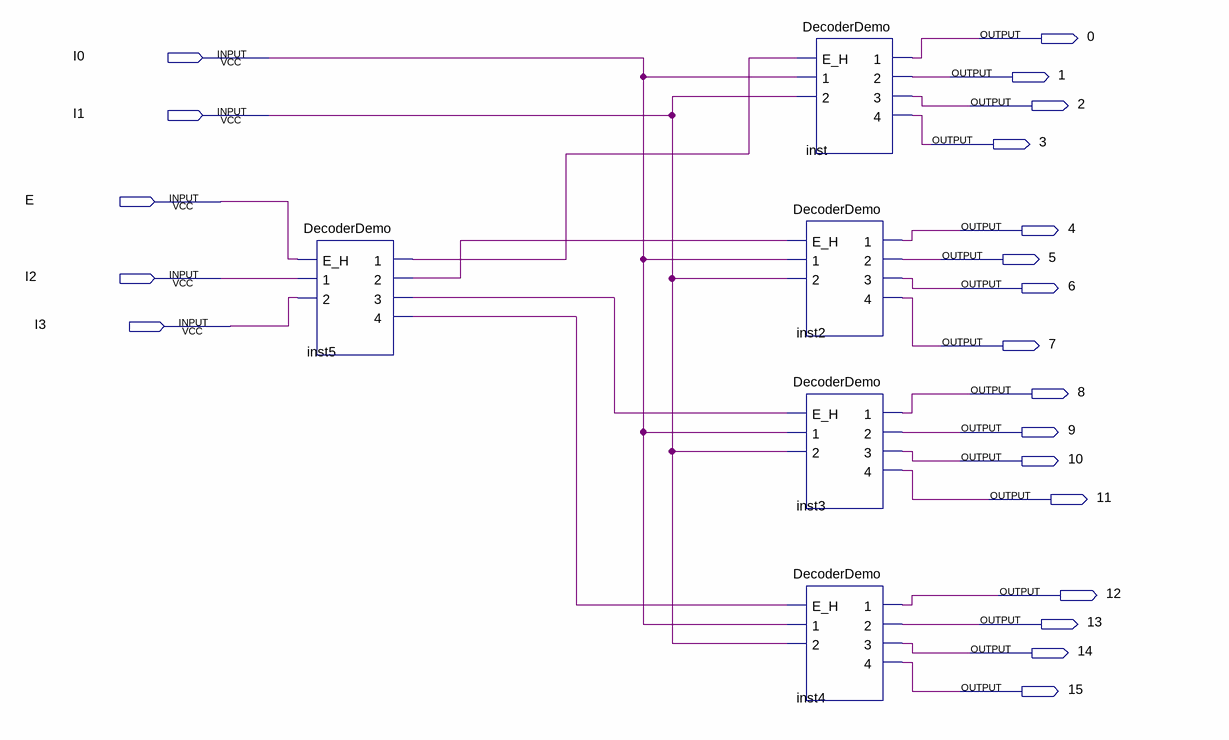
[diagram p0: schematic sheet]
// Quartus schematic 4_16.bdf as structural Verilog: 5 symbols, 21 pins
module \4_16  (
  input  I0,
  input  I1,
  input  E,
  input  I2,
  input  I3,
  output \0 ,
  output \1 ,
  output \2 ,
  output \3 ,
  output \4 ,
  output \5 ,
  output \6 ,
  output \7 ,
  output \8 ,
  output \9 ,
  output \10 ,
  output \11 ,
  output \12 ,
  output \13 ,
  output \14 ,
  output \15 
);

  wire inst5_1, inst5_2, inst5_3, inst5_4;

  DecoderDemo inst5 (.E_H(E), .\1 ({I2, inst5_1}), .\2 ({I3, inst5_2}), .\3 (inst5_3), .\4 (inst5_4));
  DecoderDemo inst (.E_H(inst5_1), .\1 ({I0, \0 }), .\2 ({I1, \1 }), .\3 (\2 ), .\4 (\3 ));
  DecoderDemo inst2 (.E_H(inst5_2), .\1 ({I0, \4 }), .\2 ({I1, \5 }), .\3 (\6 ), .\4 (\7 ));
  DecoderDemo inst3 (.E_H(inst5_3), .\1 ({I0, \8 }), .\2 ({I1, \9 }), .\3 (\10 ), .\4 (\11 ));
  DecoderDemo inst4 (.E_H(inst5_4), .\1 ({I0, \12 }), .\2 ({I1, \13 }), .\3 (\14 ), .\4 (\15 ));
endmodule
